# Altium schematic sheet Top.SchDoc: Top
size A3; Project: STM32H7-DK; Date: Not used; ApprovedBy: Not used; CheckedBy: Not used; Author: Not used; CompanyName: STMicroelectronics; DrawnBy: Not used; Engineer: Not used; Organization: Not used; Address1: Not used; Address2: Not used; Address3: Not used; Address4: Not used; DocumentNumber: Not used; Revision: Not used; SheetNumber: 2; SheetTotal: 16; CurrentTime: Not used; CurrentDate: Not used; Time: Not used; DocumentFullPathAndName: Not used; DocumentName: Not used; ModifiedDate: Not used; ImagePath: Not used; ProjectName: Not used; Application_BuildNumber: Not used
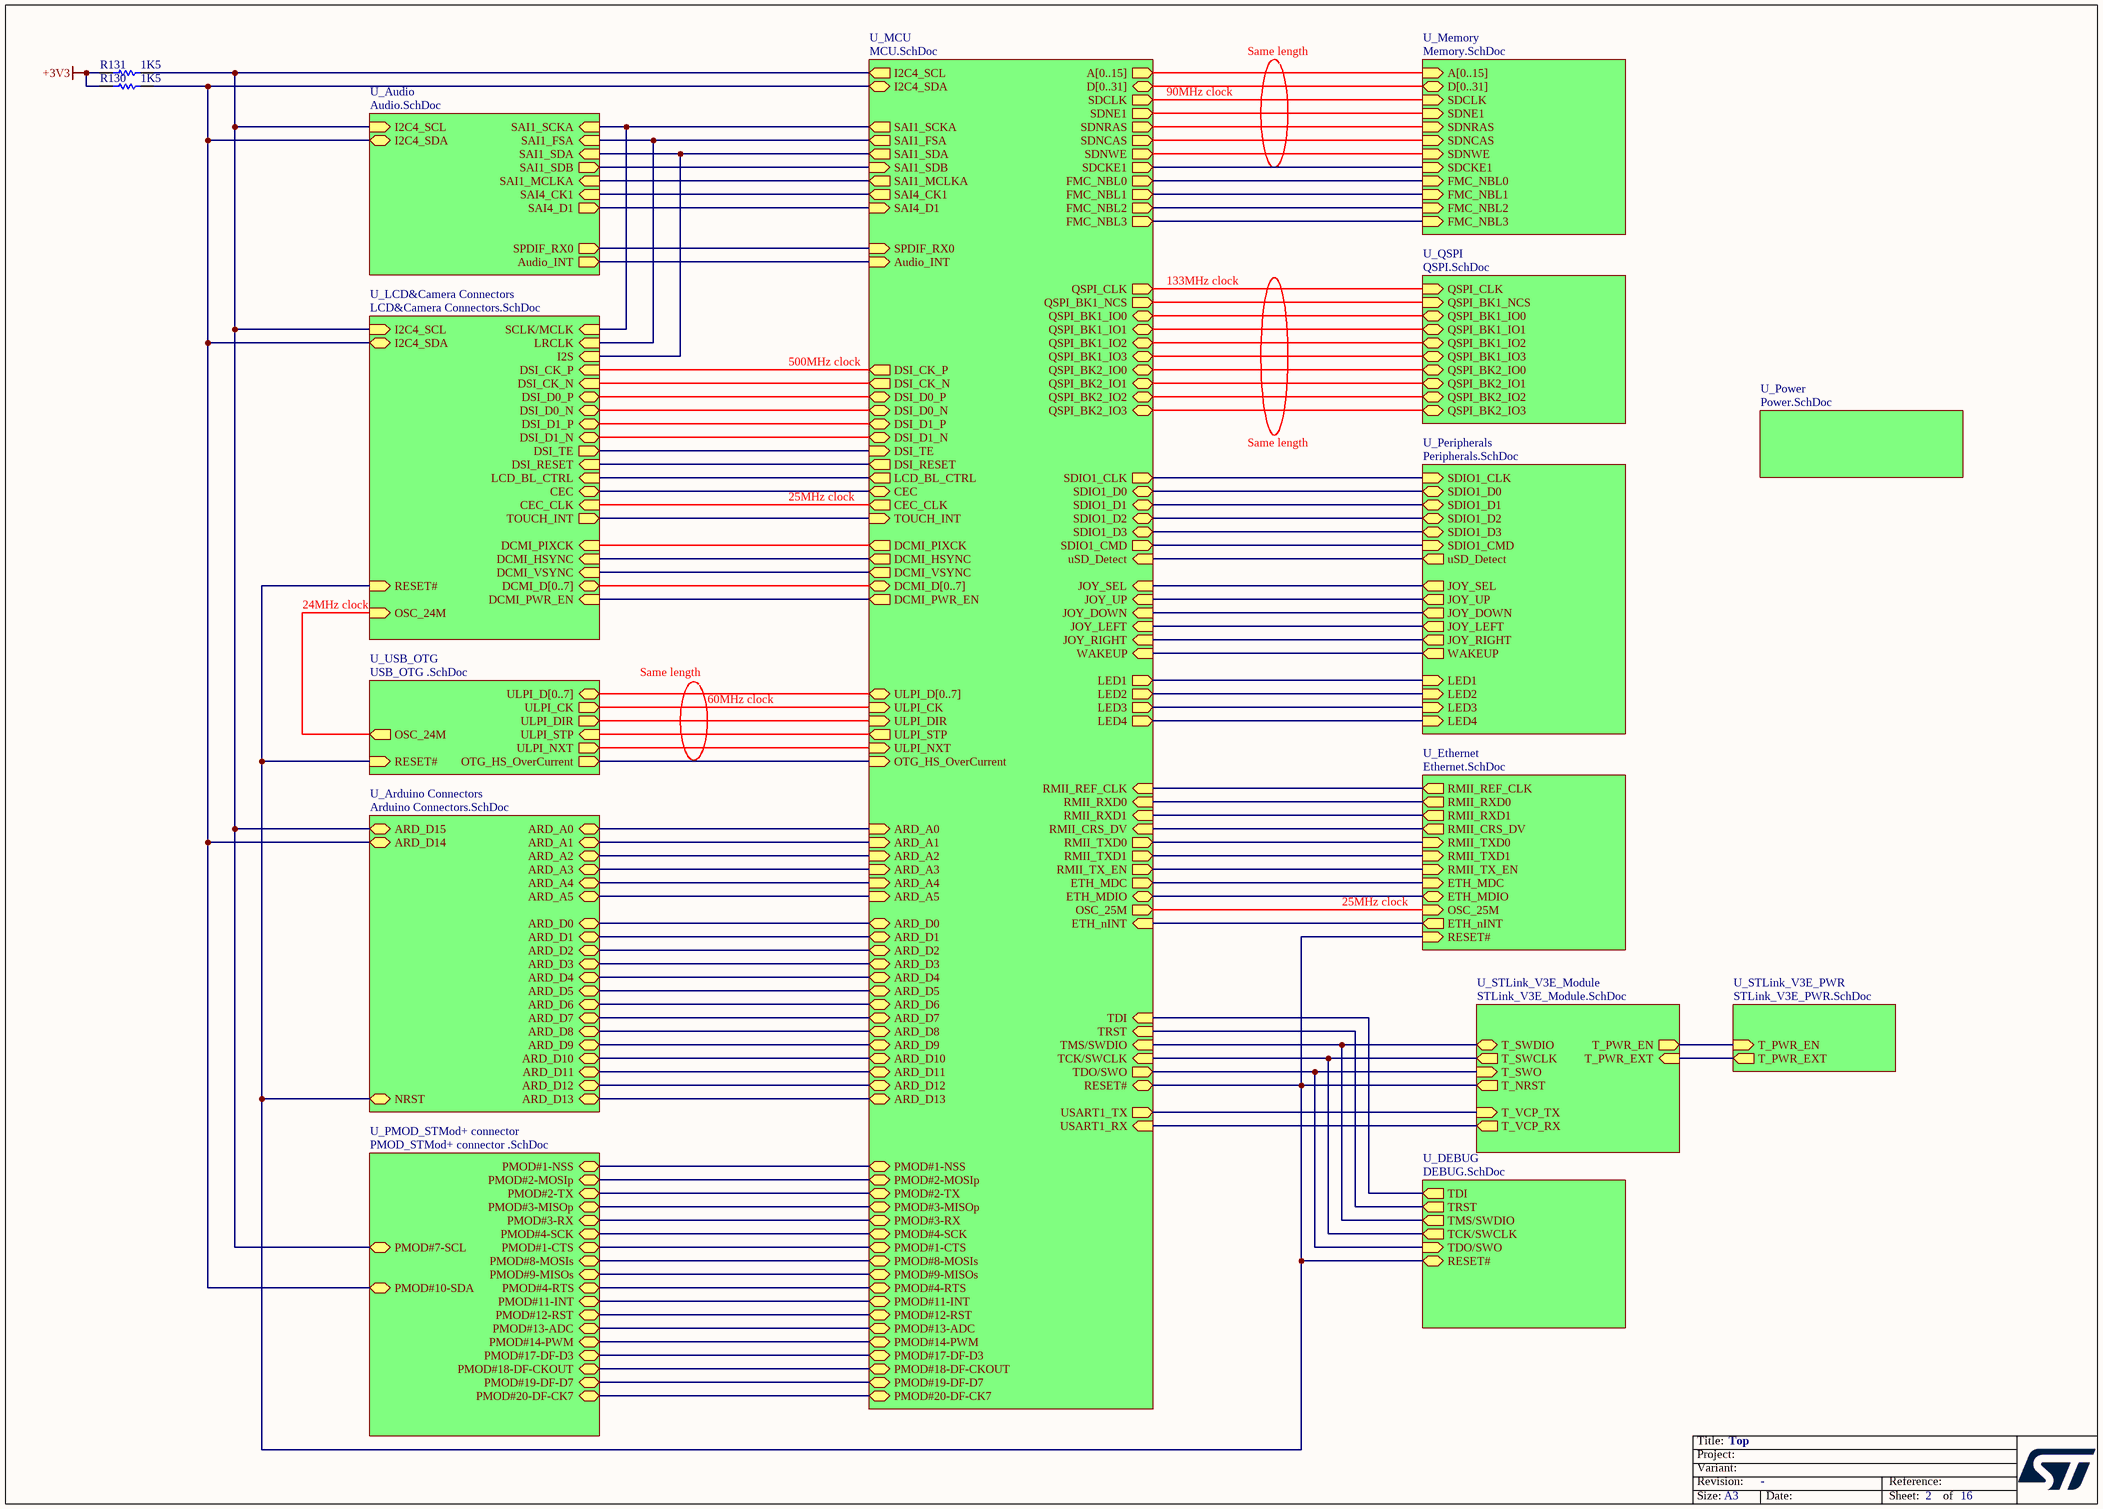
[diagram p0: Top.SchDoc]

## Parts
R130  1K5  [0603R]
R131  1K5  [0603R]

## Sub-sheets
U_Arduino Connectors = Arduino Connectors.SchDoc: NRST (bidir), ARD_A0 (bidir), ARD_A1 (bidir), ARD_A2 (bidir), ARD_A3 (bidir), ARD_A4 (bidir), ARD_A5 (bidir), ARD_D5 (bidir), ARD_D4 (bidir), ARD_D3 (bidir), ARD_D2 (bidir), ARD_D1 (bidir), ARD_D0 (bidir), ARD_D13 (bidir), ARD_D12 (bidir), ARD_D11 (bidir), ARD_D10 (bidir), ARD_D9 (bidir), ARD_D8 (bidir), ARD_D6 (bidir), ARD_D7 (bidir), ARD_D15 (bidir), ARD_D14 (bidir)
U_Audio = Audio.SchDoc: SAI1_SCKA (in), SAI1_FSA (in), SAI1_SDA (in), SAI1_SDB (out), Audio_INT (out), I2C4_SDA (bidir), I2C4_SCL (in), SAI1_MCLKA (in), SPDIF_RX0 (out), SAI4_CK1 (in), SAI4_D1 (out)
U_DEBUG = DEBUG.SchDoc: TDI (out), RESET# (bidir), TRST (out), TMS/SWDIO (out), TCK/SWCLK (out), TDO/SWO (in)
U_Ethernet = Ethernet.SchDoc: RMII_TXD0 (in), RMII_TX_EN (in), RMII_RXD0 (out), RMII_REF_CLK (out), RMII_CRS_DV (out), ETH_MDC (in), ETH_MDIO (bidir), RMII_TXD1 (in), RMII_RXD1 (out), RESET# (in), OSC_25M (in), ETH_nINT (out)
U_LCD&Camera Connectors = LCD&Camera Connectors.SchDoc: TOUCH_INT (out), DSI_CK_P (in), DSI_CK_N (in), DSI_D0_P (bidir), DSI_D0_N (bidir), DSI_D1_P (bidir), DSI_D1_N (bidir), LCD_BL_CTRL (in), DSI_TE (out), DSI_RESET (in), SCLK/MCLK (in), LRCLK (in), I2S (in), CEC (bidir), CEC_CLK (in), DCMI_D[0..7] (bidir), DCMI_PWR_EN (in), DCMI_VSYNC (in), DCMI_HSYNC (in), DCMI_PIXCK (in), RESET# (in), I2C4_SCL (in), I2C4_SDA (bidir), OSC_24M (in)
U_MCU = MCU.SchDoc: TMS/SWDIO (in), TCK/SWCLK (in), TDI (in), ULPI_STP (out), ETH_MDC (out), RMII_RXD0 (in), RMII_RXD1 (in), SDIO1_D0 (bidir), SDIO1_CLK (out), SDIO1_CMD (out), uSD_Detect (in), FMC_NBL3 (out), FMC_NBL2 (out), FMC_NBL0 (out), FMC_NBL1 (out), SAI1_SDA (out), SAI1_SDB (in), SAI1_SCKA (out), SAI1_FSA (out), SAI1_MCLKA (out), SDNRAS (out), SDCLK (out), RMII_TX_EN (out), RMII_TXD1 (out), SDNCAS (out), SDCKE1 (out), SDNE1 (out), ULPI_NXT (in), SDNWE (out), D[0..31] (bidir), A[0..15] (out), ULPI_D[0..7] (bidir), QSPI_BK1_IO3 (bidir), QSPI_BK1_IO2 (bidir), QSPI_BK1_IO1 (bidir), DSI_TE (in), DSI_CK_P (out), DSI_CK_N (out), DSI_D0_P (bidir), DSI_D0_N (bidir), DSI_D1_P (bidir), DSI_D1_N (bidir), ARD_A1 (in), LED1 (out), LED2 (out), LED3 (out), LED4 (out), RMII_REF_CLK (in), ETH_MDIO (bidir), ULPI_CK (in), RMII_CRS_DV (in), CEC_CLK (out), TDO/SWO (out), TRST (in), QSPI_BK1_NCS (out), RMII_TXD0 (out), QSPI_CLK (out), SDIO1_D1 (bidir), SDIO1_D2 (bidir), SDIO1_D3 (bidir), QSPI_BK2_IO2 (bidir), QSPI_BK2_IO3 (bidir), QSPI_BK2_IO0 (bidir), QSPI_BK2_IO1 (bidir), RESET# (bidir), CEC (bidir), DCMI_PWR_EN (out), DCMI_VSYNC (out), DCMI_HSYNC (out), DCMI_PIXCK (out), ARD_A0 (in), ARD_A2 (in), ARD_A3 (in), ARD_A5 (in), ARD_A4 (in), ARD_D10 (bidir), ARD_D11 (bidir), ARD_D12 (bidir), ARD_D13 (bidir), I2C4_SCL (out), I2C4_SDA (bidir), ARD_D1 (bidir), ARD_D2 (bidir), ARD_D3 (bidir), ARD_D4 (bidir), ARD_D5 (bidir), ARD_D6 (bidir), ARD_D7 (bidir), ARD_D8 (bidir), ARD_D9 (bidir), ARD_D0 (bidir), Audio_INT (in), LCD_BL_CTRL (out), DSI_RESET (out), JOY_SEL (in), JOY_DOWN (in), JOY_LEFT (in), JOY_RIGHT (in), JOY_UP (in), TOUCH_INT (in), OTG_HS_OverCurrent (in), QSPI_BK1_IO0 (bidir), SPDIF_RX0 (in), ULPI_DIR (in), OSC_25M (out), DCMI_D[0..7] (bidir), PMOD#3-MISOp (bidir), PMOD#2-TX (bidir), PMOD#2-MOSIp (bidir), PMOD#3-RX (bidir), PMOD#8-MOSIs (bidir), PMOD#9-MISOs (bidir), PMOD#11-INT (bidir), PMOD#12-RST (bidir), PMOD#13-ADC (bidir), PMOD#14-PWM (bidir), PMOD#17-DF-D3 (bidir), PMOD#19-DF-D7 (bidir), PMOD#20-DF-CK7 (bidir), WAKEUP (in), PMOD#18-DF-CKOUT (bidir), SAI4_CK1 (out), SAI4_D1 (in), PMOD#1-NSS (bidir), PMOD#4-RTS (bidir), USART1_TX (out), PMOD#1-CTS (bidir), PMOD#4-SCK (bidir), USART1_RX (in), ETH_nINT (in)
U_Memory = Memory.SchDoc: FMC_NBL0 (in), FMC_NBL1 (in), D[0..31] (bidir), A[0..15] (in), SDNCAS (in), SDNWE (in), SDNRAS (in), SDNE1 (in), SDCKE1 (in), SDCLK (in), FMC_NBL3 (in), FMC_NBL2 (in)
U_Peripherals = Peripherals.SchDoc: JOY_SEL (out), JOY_DOWN (out), JOY_LEFT (out), JOY_RIGHT (out), JOY_UP (out), LED4 (in), LED3 (in), LED1 (in), LED2 (in), uSD_Detect (out), WAKEUP (out), SDIO1_CLK (in), SDIO1_CMD (in), SDIO1_D0 (bidir), SDIO1_D1 (bidir), SDIO1_D2 (bidir), SDIO1_D3 (bidir)
U_PMOD_STMod+ connector = PMOD_STMod+ connector .SchDoc: PMOD#11-INT (bidir), PMOD#12-RST (bidir), PMOD#1-NSS (bidir), PMOD#3-MISOp (bidir), PMOD#2-TX (bidir), PMOD#2-MOSIp (bidir), PMOD#3-RX (bidir), PMOD#7-SCL (bidir), PMOD#4-SCK (bidir), PMOD#8-MOSIs (bidir), PMOD#9-MISOs (bidir), PMOD#10-SDA (bidir), PMOD#13-ADC (bidir), PMOD#14-PWM (bidir), PMOD#17-DF-D3 (bidir), PMOD#18-DF-CKOUT (bidir), PMOD#19-DF-D7 (bidir), PMOD#20-DF-CK7 (bidir), PMOD#1-CTS (bidir), PMOD#4-RTS (bidir)
U_Power = Power.SchDoc: no entries
U_QSPI = QSPI.SchDoc: QSPI_BK1_IO3 (bidir), QSPI_BK1_IO1 (bidir), QSPI_BK1_NCS (in), QSPI_BK1_IO0 (bidir), QSPI_BK1_IO2 (bidir), QSPI_CLK (in), QSPI_BK2_IO0 (bidir), QSPI_BK2_IO1 (bidir), QSPI_BK2_IO2 (bidir), QSPI_BK2_IO3 (bidir)
U_STLink_V3E_Module = STLink_V3E_Module.SchDoc: T_SWCLK (out), T_SWO (in), T_NRST (out), T_SWDIO (bidir), T_PWR_EXT (in), T_PWR_EN (out), T_VCP_RX (out), T_VCP_TX (in)
U_STLink_V3E_PWR = STLink_V3E_PWR.SchDoc: T_PWR_EXT (out), T_PWR_EN (in)
U_USB_OTG = USB_OTG .SchDoc: ULPI_D[0..7] (bidir), ULPI_CK (out), ULPI_DIR (out), ULPI_NXT (out), ULPI_STP (in), RESET# (in), OTG_HS_OverCurrent (out), OSC_24M (out)

## Nets
+3V3: R130.1 R131.1
NetR130_2: R130.2 ; sheet U_MCU/I2C4_SDA, sheet U_Audio/I2C4_SDA, sheet U_Arduino Connectors/ARD_D14, sheet U_LCD&Camera Connectors/I2C4_SDA, sheet U_PMOD_STMod+ connector/PMOD#10-SDA
NetR131_2: R131.2 ; sheet U_MCU/I2C4_SCL, sheet U_Audio/I2C4_SCL, sheet U_Arduino Connectors/ARD_D15, sheet U_LCD&Camera Connectors/I2C4_SCL, sheet U_PMOD_STMod+ connector/PMOD#7-SCL
(unnamed): sheet U_MCU/TMS/SWDIO, sheet U_DEBUG/TMS/SWDIO, sheet U_STLink_V3E_Module/T_SWDIO
(unnamed): sheet U_MCU/TCK/SWCLK, sheet U_DEBUG/TCK/SWCLK, sheet U_STLink_V3E_Module/T_SWCLK
(unnamed): sheet U_MCU/TDI, sheet U_DEBUG/TDI
(unnamed): sheet U_MCU/ULPI_STP, sheet U_USB_OTG/ULPI_STP
(unnamed): sheet U_MCU/ETH_MDC, sheet U_Ethernet/ETH_MDC
(unnamed): sheet U_MCU/RMII_RXD0, sheet U_Ethernet/RMII_RXD0
(unnamed): sheet U_MCU/RMII_RXD1, sheet U_Ethernet/RMII_RXD1
(unnamed): sheet U_MCU/SDIO1_D0, sheet U_Peripherals/SDIO1_D0
(unnamed): sheet U_MCU/SDIO1_CLK, sheet U_Peripherals/SDIO1_CLK
(unnamed): sheet U_MCU/SDIO1_CMD, sheet U_Peripherals/SDIO1_CMD
(unnamed): sheet U_MCU/uSD_Detect, sheet U_Peripherals/uSD_Detect
(unnamed): sheet U_MCU/FMC_NBL3, sheet U_Memory/FMC_NBL3
(unnamed): sheet U_MCU/FMC_NBL2, sheet U_Memory/FMC_NBL2
(unnamed): sheet U_MCU/FMC_NBL0, sheet U_Memory/FMC_NBL0
(unnamed): sheet U_MCU/FMC_NBL1, sheet U_Memory/FMC_NBL1
(unnamed): sheet U_MCU/SAI1_SDA, sheet U_Audio/SAI1_SDA, sheet U_LCD&Camera Connectors/I2S
(unnamed): sheet U_MCU/SAI1_SDB, sheet U_Audio/SAI1_SDB
(unnamed): sheet U_MCU/SAI1_SCKA, sheet U_Audio/SAI1_SCKA, sheet U_LCD&Camera Connectors/SCLK/MCLK
(unnamed): sheet U_MCU/SAI1_FSA, sheet U_Audio/SAI1_FSA, sheet U_LCD&Camera Connectors/LRCLK
(unnamed): sheet U_MCU/SAI1_MCLKA, sheet U_Audio/SAI1_MCLKA
(unnamed): sheet U_MCU/SDNRAS, sheet U_Memory/SDNRAS
(unnamed): sheet U_MCU/SDCLK, sheet U_Memory/SDCLK
(unnamed): sheet U_MCU/RMII_TX_EN, sheet U_Ethernet/RMII_TX_EN
(unnamed): sheet U_MCU/RMII_TXD1, sheet U_Ethernet/RMII_TXD1
(unnamed): sheet U_MCU/SDNCAS, sheet U_Memory/SDNCAS
(unnamed): sheet U_MCU/SDCKE1, sheet U_Memory/SDCKE1
(unnamed): sheet U_MCU/SDNE1, sheet U_Memory/SDNE1
(unnamed): sheet U_MCU/ULPI_NXT, sheet U_USB_OTG/ULPI_NXT
(unnamed): sheet U_MCU/SDNWE, sheet U_Memory/SDNWE
(unnamed): sheet U_MCU/QSPI_BK1_IO3, sheet U_QSPI/QSPI_BK1_IO3
(unnamed): sheet U_MCU/QSPI_BK1_IO2, sheet U_QSPI/QSPI_BK1_IO2
(unnamed): sheet U_MCU/QSPI_BK1_IO1, sheet U_QSPI/QSPI_BK1_IO1
(unnamed): sheet U_MCU/DSI_TE, sheet U_LCD&Camera Connectors/DSI_TE
(unnamed): sheet U_MCU/DSI_CK_P, sheet U_LCD&Camera Connectors/DSI_CK_P
(unnamed): sheet U_MCU/DSI_CK_N, sheet U_LCD&Camera Connectors/DSI_CK_N
(unnamed): sheet U_MCU/DSI_D0_P, sheet U_LCD&Camera Connectors/DSI_D0_P
(unnamed): sheet U_MCU/DSI_D0_N, sheet U_LCD&Camera Connectors/DSI_D0_N
(unnamed): sheet U_MCU/DSI_D1_P, sheet U_LCD&Camera Connectors/DSI_D1_P
(unnamed): sheet U_MCU/DSI_D1_N, sheet U_LCD&Camera Connectors/DSI_D1_N
(unnamed): sheet U_MCU/ARD_A1, sheet U_Arduino Connectors/ARD_A1
(unnamed): sheet U_MCU/LED1, sheet U_Peripherals/LED1
(unnamed): sheet U_MCU/LED2, sheet U_Peripherals/LED2
(unnamed): sheet U_MCU/LED3, sheet U_Peripherals/LED3
(unnamed): sheet U_MCU/LED4, sheet U_Peripherals/LED4
(unnamed): sheet U_MCU/RMII_REF_CLK, sheet U_Ethernet/RMII_REF_CLK
(unnamed): sheet U_MCU/ETH_MDIO, sheet U_Ethernet/ETH_MDIO
(unnamed): sheet U_MCU/ULPI_CK, sheet U_USB_OTG/ULPI_CK
(unnamed): sheet U_MCU/RMII_CRS_DV, sheet U_Ethernet/RMII_CRS_DV
(unnamed): sheet U_MCU/CEC_CLK, sheet U_LCD&Camera Connectors/CEC_CLK
(unnamed): sheet U_MCU/TDO/SWO, sheet U_DEBUG/TDO/SWO, sheet U_STLink_V3E_Module/T_SWO
(unnamed): sheet U_MCU/TRST, sheet U_DEBUG/TRST
(unnamed): sheet U_MCU/QSPI_BK1_NCS, sheet U_QSPI/QSPI_BK1_NCS
(unnamed): sheet U_MCU/RMII_TXD0, sheet U_Ethernet/RMII_TXD0
(unnamed): sheet U_MCU/QSPI_CLK, sheet U_QSPI/QSPI_CLK
(unnamed): sheet U_MCU/SDIO1_D1, sheet U_Peripherals/SDIO1_D1
(unnamed): sheet U_MCU/SDIO1_D2, sheet U_Peripherals/SDIO1_D2
(unnamed): sheet U_MCU/SDIO1_D3, sheet U_Peripherals/SDIO1_D3
(unnamed): sheet U_MCU/QSPI_BK2_IO2, sheet U_QSPI/QSPI_BK2_IO2
(unnamed): sheet U_MCU/QSPI_BK2_IO3, sheet U_QSPI/QSPI_BK2_IO3
(unnamed): sheet U_MCU/QSPI_BK2_IO0, sheet U_QSPI/QSPI_BK2_IO0
(unnamed): sheet U_MCU/QSPI_BK2_IO1, sheet U_QSPI/QSPI_BK2_IO1
(unnamed): sheet U_MCU/RESET#, sheet U_Ethernet/RESET#, sheet U_Arduino Connectors/NRST, sheet U_USB_OTG/RESET#, sheet U_LCD&Camera Connectors/RESET#, sheet U_DEBUG/RESET#, sheet U_STLink_V3E_Module/T_NRST
(unnamed): sheet U_MCU/CEC, sheet U_LCD&Camera Connectors/CEC
(unnamed): sheet U_MCU/DCMI_PWR_EN, sheet U_LCD&Camera Connectors/DCMI_PWR_EN
(unnamed): sheet U_MCU/DCMI_VSYNC, sheet U_LCD&Camera Connectors/DCMI_VSYNC
(unnamed): sheet U_MCU/DCMI_HSYNC, sheet U_LCD&Camera Connectors/DCMI_HSYNC
(unnamed): sheet U_MCU/DCMI_PIXCK, sheet U_LCD&Camera Connectors/DCMI_PIXCK
(unnamed): sheet U_MCU/ARD_A0, sheet U_Arduino Connectors/ARD_A0
(unnamed): sheet U_MCU/ARD_A2, sheet U_Arduino Connectors/ARD_A2
(unnamed): sheet U_MCU/ARD_A3, sheet U_Arduino Connectors/ARD_A3
(unnamed): sheet U_MCU/ARD_A5, sheet U_Arduino Connectors/ARD_A5
(unnamed): sheet U_MCU/ARD_A4, sheet U_Arduino Connectors/ARD_A4
(unnamed): sheet U_MCU/ARD_D10, sheet U_Arduino Connectors/ARD_D10
(unnamed): sheet U_MCU/ARD_D11, sheet U_Arduino Connectors/ARD_D11
(unnamed): sheet U_MCU/ARD_D12, sheet U_Arduino Connectors/ARD_D12
(unnamed): sheet U_MCU/ARD_D13, sheet U_Arduino Connectors/ARD_D13
(unnamed): sheet U_MCU/ARD_D1, sheet U_Arduino Connectors/ARD_D1
(unnamed): sheet U_MCU/ARD_D2, sheet U_Arduino Connectors/ARD_D2
(unnamed): sheet U_MCU/ARD_D3, sheet U_Arduino Connectors/ARD_D3
(unnamed): sheet U_MCU/ARD_D4, sheet U_Arduino Connectors/ARD_D4
(unnamed): sheet U_MCU/ARD_D5, sheet U_Arduino Connectors/ARD_D5
(unnamed): sheet U_MCU/ARD_D6, sheet U_Arduino Connectors/ARD_D6
(unnamed): sheet U_MCU/ARD_D7, sheet U_Arduino Connectors/ARD_D7
(unnamed): sheet U_MCU/ARD_D8, sheet U_Arduino Connectors/ARD_D8
(unnamed): sheet U_MCU/ARD_D9, sheet U_Arduino Connectors/ARD_D9
(unnamed): sheet U_MCU/ARD_D0, sheet U_Arduino Connectors/ARD_D0
(unnamed): sheet U_MCU/Audio_INT, sheet U_Audio/Audio_INT
(unnamed): sheet U_MCU/LCD_BL_CTRL, sheet U_LCD&Camera Connectors/LCD_BL_CTRL
(unnamed): sheet U_MCU/DSI_RESET, sheet U_LCD&Camera Connectors/DSI_RESET
(unnamed): sheet U_MCU/JOY_SEL, sheet U_Peripherals/JOY_SEL
(unnamed): sheet U_MCU/JOY_DOWN, sheet U_Peripherals/JOY_DOWN
(unnamed): sheet U_MCU/JOY_LEFT, sheet U_Peripherals/JOY_LEFT
(unnamed): sheet U_MCU/JOY_RIGHT, sheet U_Peripherals/JOY_RIGHT
(unnamed): sheet U_MCU/JOY_UP, sheet U_Peripherals/JOY_UP
(unnamed): sheet U_MCU/TOUCH_INT, sheet U_LCD&Camera Connectors/TOUCH_INT
(unnamed): sheet U_MCU/OTG_HS_OverCurrent, sheet U_USB_OTG/OTG_HS_OverCurrent
(unnamed): sheet U_MCU/QSPI_BK1_IO0, sheet U_QSPI/QSPI_BK1_IO0
(unnamed): sheet U_MCU/SPDIF_RX0, sheet U_Audio/SPDIF_RX0
(unnamed): sheet U_MCU/ULPI_DIR, sheet U_USB_OTG/ULPI_DIR
(unnamed): sheet U_MCU/OSC_25M, sheet U_Ethernet/OSC_25M
(unnamed): sheet U_MCU/PMOD#3-MISOp, sheet U_PMOD_STMod+ connector/PMOD#3-MISOp
(unnamed): sheet U_MCU/PMOD#2-TX, sheet U_PMOD_STMod+ connector/PMOD#2-TX
(unnamed): sheet U_MCU/PMOD#2-MOSIp, sheet U_PMOD_STMod+ connector/PMOD#2-MOSIp
(unnamed): sheet U_MCU/PMOD#3-RX, sheet U_PMOD_STMod+ connector/PMOD#3-RX
(unnamed): sheet U_MCU/PMOD#8-MOSIs, sheet U_PMOD_STMod+ connector/PMOD#8-MOSIs
(unnamed): sheet U_MCU/PMOD#9-MISOs, sheet U_PMOD_STMod+ connector/PMOD#9-MISOs
(unnamed): sheet U_MCU/PMOD#11-INT, sheet U_PMOD_STMod+ connector/PMOD#11-INT
(unnamed): sheet U_MCU/PMOD#12-RST, sheet U_PMOD_STMod+ connector/PMOD#12-RST
(unnamed): sheet U_MCU/PMOD#13-ADC, sheet U_PMOD_STMod+ connector/PMOD#13-ADC
(unnamed): sheet U_MCU/PMOD#14-PWM, sheet U_PMOD_STMod+ connector/PMOD#14-PWM
(unnamed): sheet U_MCU/PMOD#17-DF-D3, sheet U_PMOD_STMod+ connector/PMOD#17-DF-D3
(unnamed): sheet U_MCU/PMOD#19-DF-D7, sheet U_PMOD_STMod+ connector/PMOD#19-DF-D7
(unnamed): sheet U_MCU/PMOD#20-DF-CK7, sheet U_PMOD_STMod+ connector/PMOD#20-DF-CK7
(unnamed): sheet U_MCU/WAKEUP, sheet U_Peripherals/WAKEUP
(unnamed): sheet U_MCU/PMOD#18-DF-CKOUT, sheet U_PMOD_STMod+ connector/PMOD#18-DF-CKOUT
(unnamed): sheet U_MCU/SAI4_CK1, sheet U_Audio/SAI4_CK1
(unnamed): sheet U_MCU/SAI4_D1, sheet U_Audio/SAI4_D1
(unnamed): sheet U_MCU/PMOD#1-NSS, sheet U_PMOD_STMod+ connector/PMOD#1-NSS
(unnamed): sheet U_MCU/PMOD#4-RTS, sheet U_PMOD_STMod+ connector/PMOD#4-RTS
(unnamed): sheet U_MCU/USART1_TX, sheet U_STLink_V3E_Module/T_VCP_TX
(unnamed): sheet U_MCU/PMOD#1-CTS, sheet U_PMOD_STMod+ connector/PMOD#1-CTS
(unnamed): sheet U_MCU/PMOD#4-SCK, sheet U_PMOD_STMod+ connector/PMOD#4-SCK
(unnamed): sheet U_MCU/USART1_RX, sheet U_STLink_V3E_Module/T_VCP_RX
(unnamed): sheet U_MCU/ETH_nINT, sheet U_Ethernet/ETH_nINT
(unnamed): sheet U_USB_OTG/OSC_24M, sheet U_LCD&Camera Connectors/OSC_24M
(unnamed): sheet U_STLink_V3E_Module/T_PWR_EXT, sheet U_STLink_V3E_PWR/T_PWR_EXT
(unnamed): sheet U_STLink_V3E_Module/T_PWR_EN, sheet U_STLink_V3E_PWR/T_PWR_EN

## Buses and harness runs
bus sheet U_LCD&Camera Connectors/DCMI_D[0..7] = sheet U_MCU/DCMI_D[0..7]
bus sheet U_MCU/A[0..15] = sheet U_Memory/A[0..15]
bus sheet U_MCU/D[0..31] = sheet U_Memory/D[0..31]
bus sheet U_MCU/ULPI_D[0..7] = sheet U_USB_OTG/ULPI_D[0..7]

## Notes on the sheet
- 90MHz clock
- Same length
- 133MHz clock
- 500MHz clock
- 25MHz clock
- 24MHz clock
- 60MHz clock
- Title:
- Project:
- Size:
- Revision:
- Variant:
- A3
- -
- Date:
- Reference:
- Sheet:
- of

## Library data of the parts
R130 R131 = Res1: Resistor; Value: 1K; Published: 8-Jun-2000; Revision: July-2002: Re-released for DXP Platform.; Publisher: Altium Limited